# Altium schematic sheet Connectors.SchDoc: Connectors
size 431 x 279 mm; Author: Alberto Marrone, Christian Schmitz, Leo Walter; DrawnBy: Alberto Marrone, Christian Schmitz, Leo Walter; Engineer: Alberto Marrone, Christian Schmitz, Leo Walter; Revision: V1.0; SheetNumber: 8; Project: PCB Design Final Project
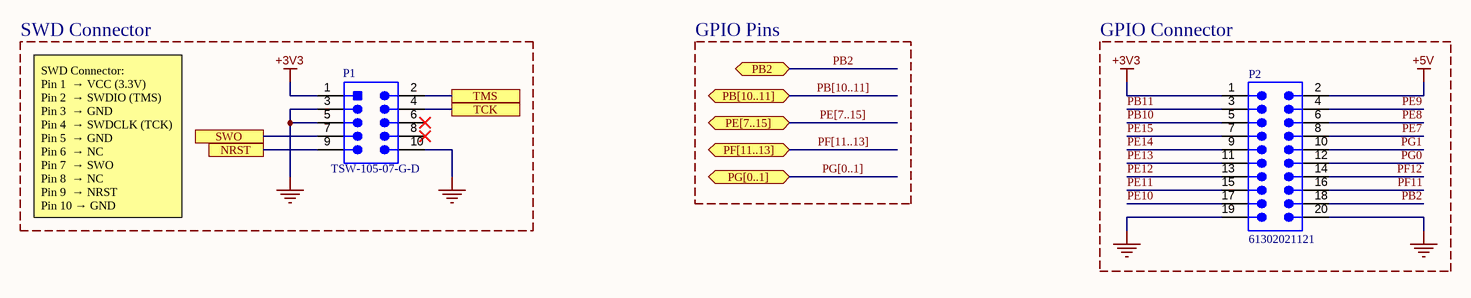
[diagram p0: Connectors.SchDoc]

## Parts
P1  TSW-105-07-G-D  [SMTC-TSW-105-07-G-D_V]
P2  61302021121  [61302021121]

## Blocks framed on the sheet
SWD Connector: P1
GPIO Connector: P2

## Ports
NRST, PB2 (bidir), PB[10..11] (bidir), PE[7..15] (bidir), PF[11..13] (bidir), PG[0..1] (bidir), SWO, TCK, TMS

## Nets
+3V3: P1.1 P2.1
+5V: P2.2
GND: P1.3 P1.5 P1.10 P2.19 P2.20
NRST: P1.9 ; port NRST
PB2: P2.18 ; port PB2
PB10: P2.5
PB11: P2.3
PE7: P2.8
PE8: P2.6
PE9: P2.4
PE10: P2.17
PE11: P2.15
PE12: P2.13
PE13: P2.11
PE14: P2.9
PE15: P2.7
PF11: P2.16
PF12: P2.14
PG0: P2.12
PG1: P2.10
SWO: P1.7 ; port SWO
TCK: P1.4 ; port TCK
TMS: P1.2 ; port TMS

Not connected (* = marked no-connect by the designer): P1 6* 8*

## Buses and harness runs
bus PB[10..11] = port PB[10..11]
bus PE[7..15] = port PE[7..15]
bus PF[11..13] = port PF[11..13]
bus PG[0..1] = port PG[0..1]

## Notes on the sheet
- GPIO Pins
- SWD Connector:
  Pin 1  → VCC (3.3V)
  Pin 2  → SWDIO (TMS)
  Pin 3  → GND
  Pin 4  → SWDCLK (TCK)
  Pin 5  → GND
  Pin 6  → NC
  Pin 7  → SWO
  Pin 8  → NC
  Pin 9  → NRST
  Pin 10 → GND
- DWG. NO.
- REV.
- SHT.
- THIS DOCUMENT AND THE DATA DISCLOSED HEREIN OR HEREWITH IS THE PROPERTY OF ALTIUM LIMITED AND MAY BE FREELY DISTRIBUTED IN WHOLE. NO RIGHTS ARE RESERVED OR EXPRESS OR IMPLIED WARANTEE GIVEN.
- REVISION
- DESCRIPTION
- DATE
- APPROVED
- ENG:
- APPROVALS
- PROJECT
- DSN:
- CHK:
- REFERENCE DOCUMENTS
- PROJECT REVISION:
- TITLE
- DOCUMENT REVISION:
- DESIGN ITEM:
- BOM:
- FAB DWG:
- PCB DWG:
- ASSY DWG:
- SCALE:
- SIZE
- B
- CAGE CODE
- FILE NAME
- DWG NO.
- SHEET
- OF
- REV

## Library data of the parts
P1 = CMP-2000-07330-1: Post Terminal Strip Assembly, Pitch 2.54 mm, 2 x 5 Position, Height 8.58 mm, Tail Length 2.54 mm, -55 to 125 degC, RoHS, Bulk; Manufacturer: Samtec-Inc.; Connector Type: Header,Unshrouded; Number of Positions Loaded: All; Pitch: 0.100"(2.54mm); Number of Positions: 10; Package Reference: TSW-105-07-G-D; Mounting Technology: ThroughHole; Datasheet URL: http://suddendocs.samtec.com/prints/tsw-xxx-xx-xxx-x-xx-xxx-mkt.pdf; Termination: Solder; Packaging: Bulk; Number of Rows: 2; Contact Finish: Gold; Mounting Type: ThroughHole; Features: -; Color: Black; Category: Connectors,Interconnects; Family: RectangularConnectors-Headers,MalePins; Manufacturer URL: http://www.samtec.com/; Series: TSW; Fastening Type: -; Package URL: http://suddendocs.samtec.com/prints/tsw-xxx-xx-x-x-xx-xxx-footprint.pdf; Row Spacing: 0.100"(2.54mm); Contact Mating Length: 0.230"(5.84mm); Contact Finish Thickness: 10µin(0.25µm); Contact Type: MalePin; Package Description: Male Header, Pitch 2.54 mm, 2 x 5 Position, Height 8.58 mm, Tail Length 2.54 mm; Datasheet Version: Rev. DO, 08/1988
P2 = CMP-1502-01104-4: THT Vertical Pin Header WR-PHD, Pitch 2.54 mm, Dual Row, 20 pins; Connector Type: Male Pin; Current Rating: 3A; Number of Contacts: 20; Gender: Male; Contact Resistance: 20mΩ; Pitch: 2.54mm; Operating Supply Voltage: 250V; Color: Black; Contact Mating Length: 5.9944mm; Termination: Solder; Packaging: Bulk; Lead Pitch: 2.54mm; Height: 8.89mm; Orientation: Vertical; Min Operating Temperature: -40°C; Max Operating Temperature: 105°C; Number of Positions: 20; Mount: Through Hole; RoHS: Compliant; Number of Pins: 20; Voltage Rating: 250V; Number of Rows: 2; Contact Plating: Gold; Row Spacing: 2.54mm; Contact Material: Gold